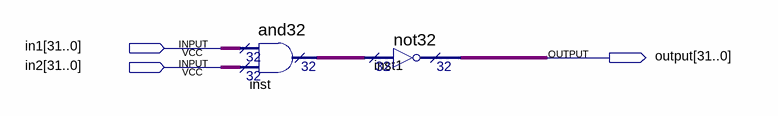
[diagram p0: schematic sheet]
// Quartus schematic nand.bdf as structural Verilog: 2 symbols, 3 pins
module \nand  (
  input  [31:0] in1,
  input  [31:0] in2,
  output [31:0] \output 
);

  wire [31:0] inst_result;

  and32 inst (.data0x(in1), .data1x(in2), .result(inst_result));
  not32 inst1 (.data(inst_result), .result(\output ));
endmodule
